# EAGLE design LF_front (EAGLE 9.6.2)
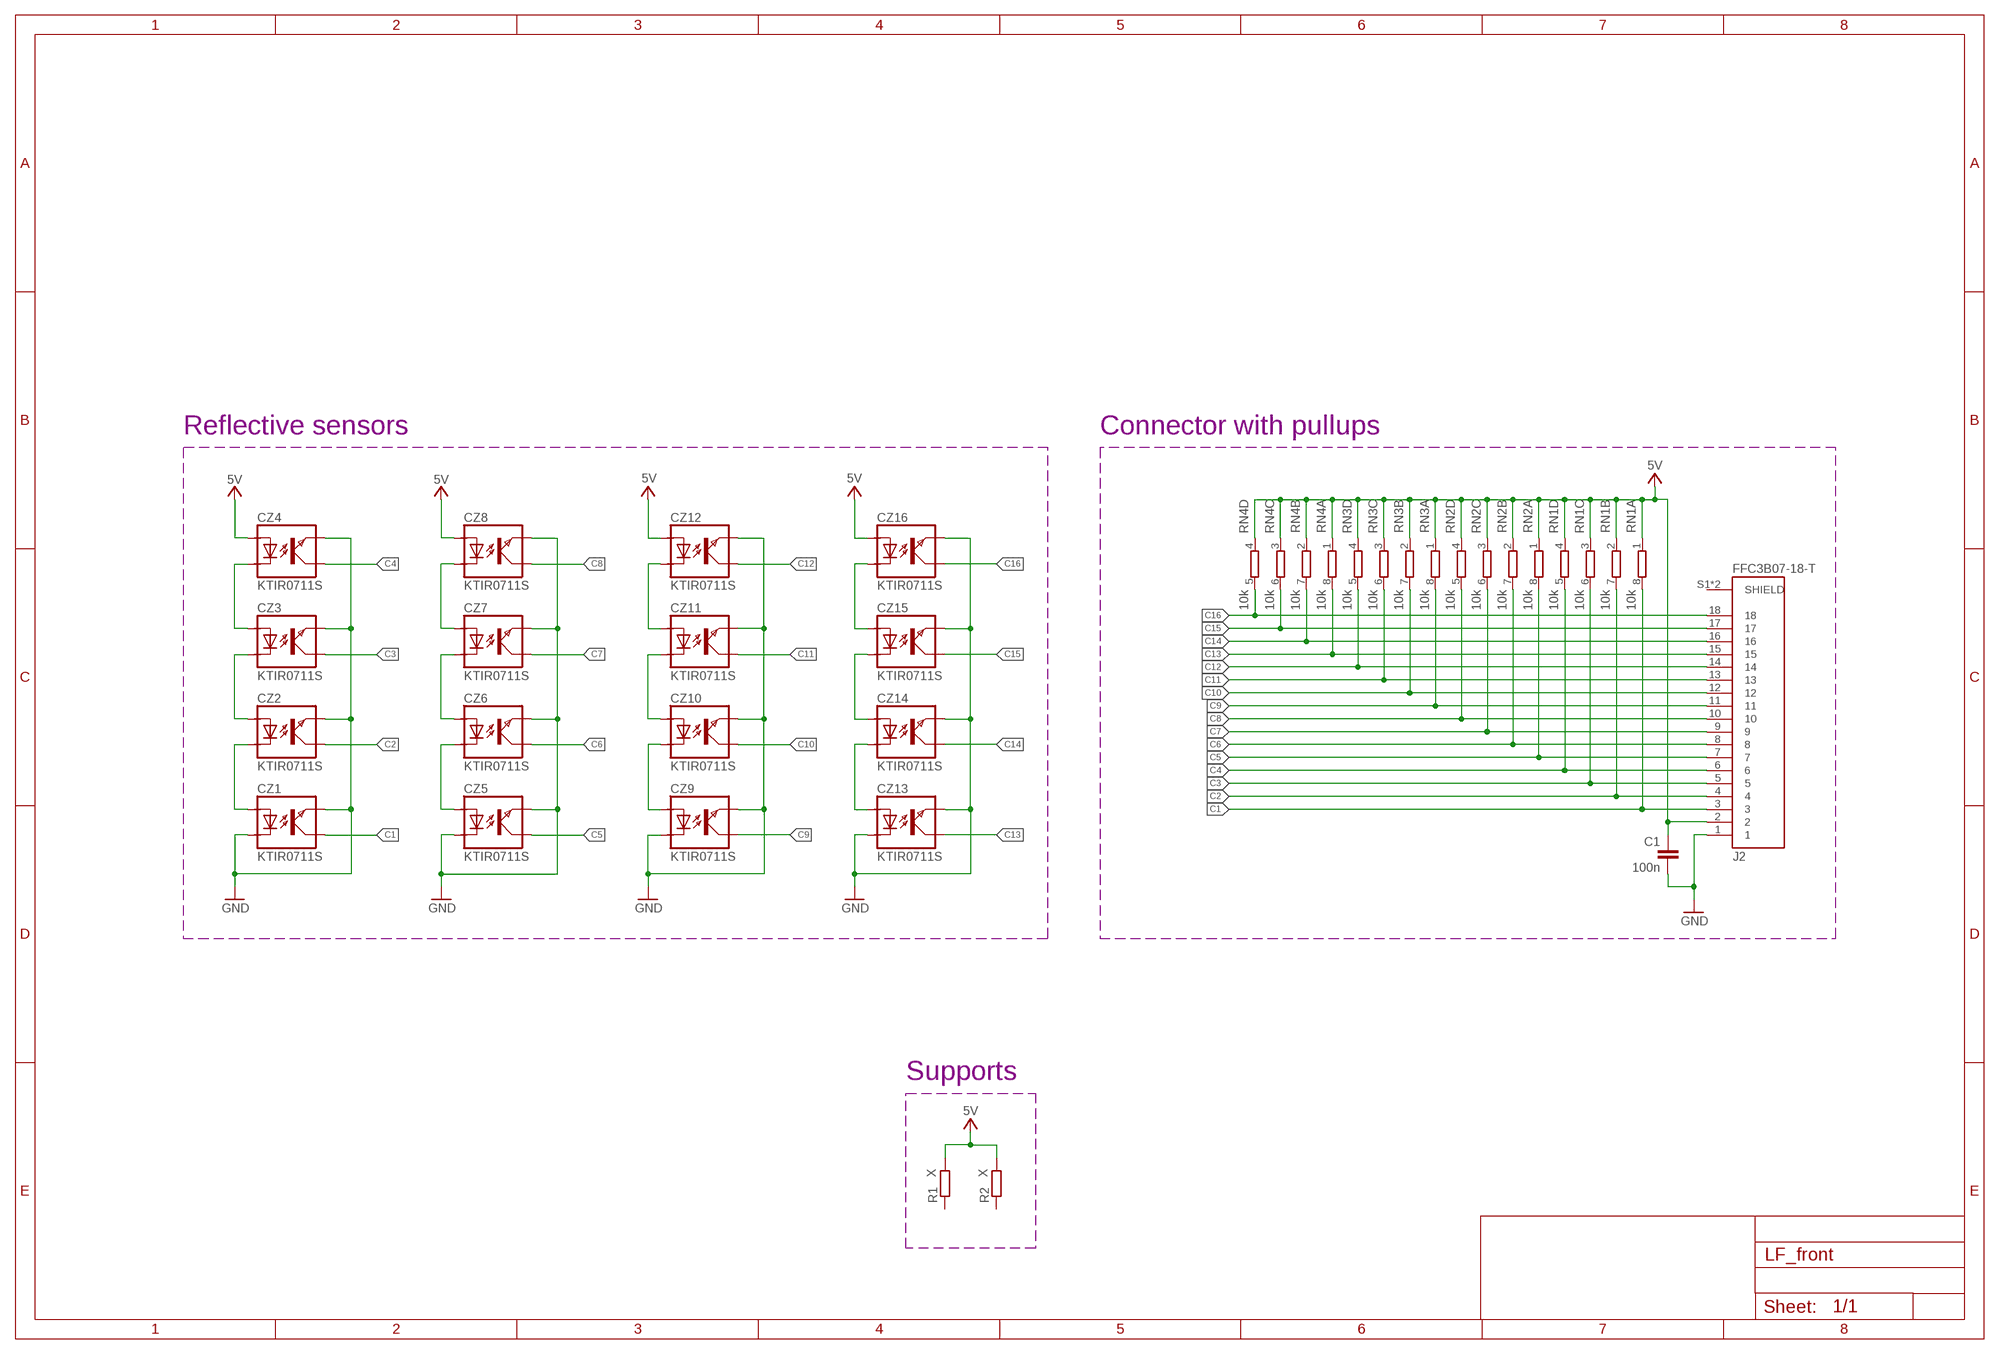
[diagram p0: schematic, sheet 1]

## Parts
C1  100n  C-EUC0402  [C0402]
CZ1  KTIR0711S  [TOP]
CZ2  KTIR0711S  [TOP]
CZ3  KTIR0711S  [TOP]
CZ4  KTIR0711S  [TOP]
CZ5  KTIR0711S  [TOP]
CZ6  KTIR0711S  [TOP]
CZ7  KTIR0711S  [TOP]
CZ8  KTIR0711S  [TOP]
CZ9  KTIR0711S  [TOP]
CZ10  KTIR0711S  [TOP]
CZ11  KTIR0711S  [TOP]
CZ12  KTIR0711S  [TOP]
CZ13  KTIR0711S  [TOP]
CZ14  KTIR0711S  [TOP]
CZ15  KTIR0711S  [TOP]
CZ16  KTIR0711S  [TOP]
J2  FFC3B07-18-T  [GCT_FFC3B07-18-T]
R1  X  R-EU_0207/7  [0207/7]
R2  X  R-EU_0207/7  [0207/7]
RN1  10k  4R-NEXB38V  [EXB38V]
RN2  10k  4R-NEXB38V  [EXB38V]
RN3  10k  4R-NEXB38V  [EXB38V]
RN4  10k  4R-NEXB38V  [EXB38V]

## Nets
5V: C1.2 CZ4.ANODA CZ8.ANODA CZ12.ANODA CZ16.ANODA J2.2 R1.2 R2.2 RN1.1 RN1.2 RN1.3 RN1.4 RN2.1 RN2.2 RN2.3 RN2.4 RN3.1 RN3.2 RN3.3 RN3.4 RN4.1 RN4.2 RN4.3 RN4.4 ; supply symbol labelled VCC
C1: CZ1.KOLEKTOR J2.3 RN1.8
C2: CZ2.KOLEKTOR J2.4 RN1.7
C3: CZ3.KOLEKTOR J2.5 RN1.6
C4: CZ4.KOLEKTOR J2.6 RN1.5
C5: CZ5.KOLEKTOR J2.7 RN2.8
C6: CZ6.KOLEKTOR J2.8 RN2.7
C7: CZ7.KOLEKTOR J2.9 RN2.6
C8: CZ8.KOLEKTOR J2.10 RN2.5
C9: CZ9.KOLEKTOR J2.11 RN3.8
C10: CZ10.KOLEKTOR J2.12 RN3.7
C11: CZ11.KOLEKTOR J2.13 RN3.6
C12: CZ12.KOLEKTOR J2.14 RN3.5
C13: CZ13.KOLEKTOR J2.15 RN4.8
C14: CZ14.KOLEKTOR J2.16 RN4.7
C15: CZ15.KOLEKTOR J2.17 RN4.6
C16: CZ16.KOLEKTOR J2.18 RN4.5
GND: C1.1 CZ1.EMITER CZ1.KATODA CZ2.EMITER CZ3.EMITER CZ4.EMITER CZ5.EMITER CZ5.KATODA CZ6.EMITER CZ7.EMITER CZ8.EMITER CZ9.EMITER CZ9.KATODA CZ10.EMITER CZ11.EMITER CZ12.EMITER CZ13.EMITER CZ13.KATODA CZ14.EMITER CZ15.EMITER CZ16.EMITER J2.1
N$2: CZ1.ANODA CZ2.KATODA
N$3: CZ2.ANODA CZ3.KATODA
N$4: CZ3.ANODA CZ4.KATODA
N$5: CZ15.ANODA CZ16.KATODA
N$6: CZ14.ANODA CZ15.KATODA
N$7: CZ13.ANODA CZ14.KATODA
N$8: CZ11.ANODA CZ12.KATODA
N$9: CZ10.ANODA CZ11.KATODA
N$10: CZ9.ANODA CZ10.KATODA
N$11: CZ5.ANODA CZ6.KATODA
N$12: CZ6.ANODA CZ7.KATODA
N$13: CZ7.ANODA CZ8.KATODA
Unconnected: J2.S1(SHIELD) J2.S2(SHIELD) R1.1 R2.1

## Notes on the sheet
- Reflective sensors | Connector with pullups
- Supports

## Library data of the parts
C1 = rcl:C-EU: CAPACITOR, European symbol; SPICEPREFIX: C
CZ1-CZ16 = KTIR0711S:KTIR0711S
J2 = FFC18T_1mm:FFC3B07-18-T: FPC 1.0mm Pitch, Side entry, Top contact, SMT, Height 2.5mm, Slide type; MANUFACTURER: GCT; MAXIMUM_PACKAGE_HEIGHT: 2.5mm; PARTREV: A; STANDARD: Manufacturer Recommendations
R1 R2 = rcl:R-EU_: RESISTOR, European symbol; SPICEPREFIX: R
RN1-RN4 = resistor-dil:4R-N: Array Chip Resistor Source: RS Component / Phycomp; OC_FARNELL: unknown; OC_NEWARK: unknown

## Board
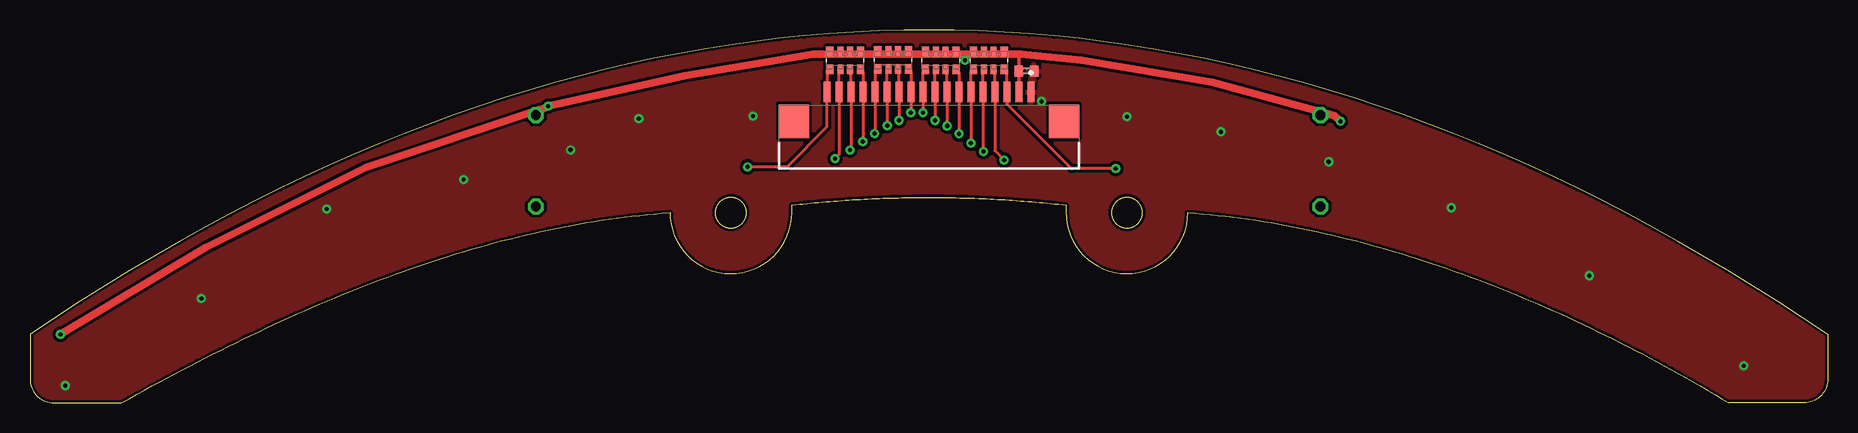
[diagram p1: board, top side]
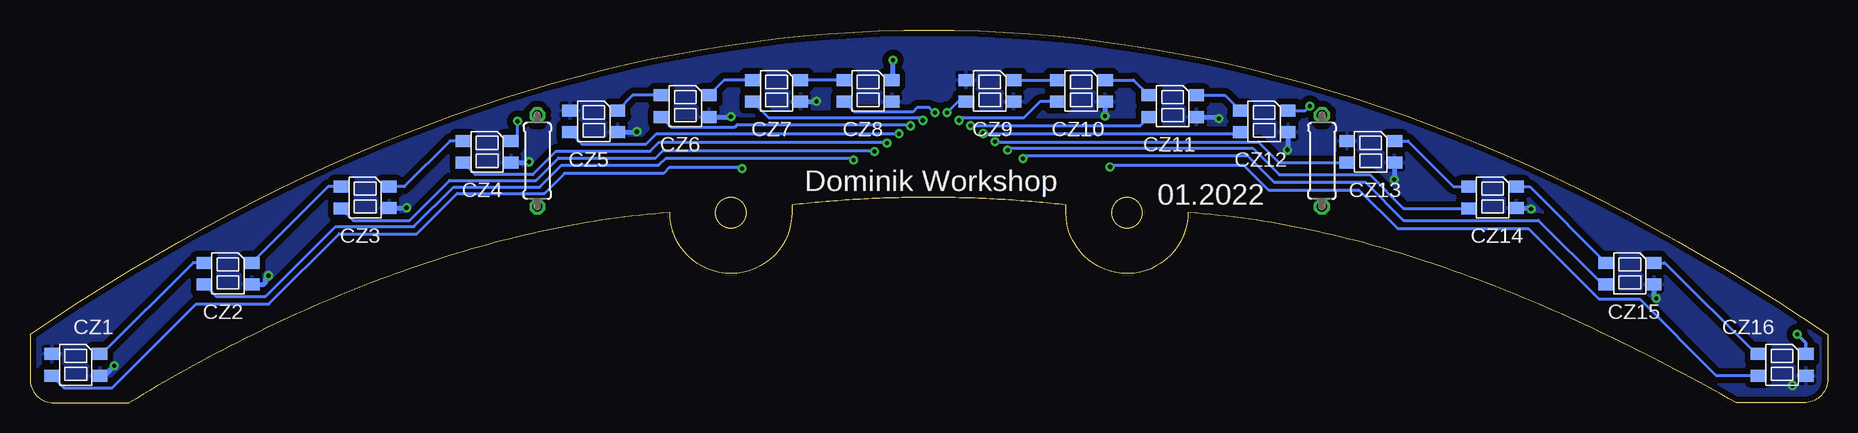
[diagram p2: board, bottom side, seen from below]

Size 149.86 x 31.12 mm. Coordinates in mm from the lower left corner, seen from the top.
Outline: 0,5.71 0,2 arc90 2,0 7.62,0 8.26,0.36 8.89,0.71 9.53,1.06 10.16,1.41 10.79,1.75 11.43,2.09 12.06,2.43 12.7,2.77 13.34,3.1 13.97,3.43 14.61,3.76 15.24,4.08 15.88,4.4 16.51,4.72 17.14,5.03 17.78,5.34 18.41,5.64 19.05,5.95 19.68,6.25 20.32,6.54 20.95,6.84 21.59,7.12 22.23,7.41 22.86,7.69 23.5,7.97 24.13,8.24 24.77,8.51 25.4,8.78 26.04,9.04 26.67,9.3 27.3,9.55 27.94,9.8 28.57,10.04 29.21,10.29 29.84,10.52 30.48,10.75 31.11,10.98 31.75,11.21 32.38,11.43 33.02,11.64 33.66,11.85 34.29,12.06 34.92,12.26 35.56,12.46 36.2,12.65 36.83,12.83 37.47,13.02 38.1,13.19 38.73,13.37 39.37,13.53 40.01,13.7 40.64,13.85 41.27,14.01 41.91,14.15 42.55,14.3 43.18,14.43 43.81,14.56 44.45,14.69 45.09,14.81 45.72,14.93 46.35,15.04 46.99,15.14 47.62,15.24 48.26,15.33 48.9,15.42 49.53,15.5 50.16,15.58 50.8,15.65 51.44,15.72 52.07,15.77 52.7,15.83 53.34,15.88 53.36,15.43 arc175 63.5,15.88 63.5,16.51 63.82,16.54 64.14,16.58 64.45,16.61 64.77,16.64 65.09,16.67 65.41,16.7 65.72,16.73 66.04,16.76 66.36,16.79 66.67,16.81 66.99,16.84 67.31,16.86 67.63,16.89 67.94,16.91 68.26,16.93 68.58,16.95 68.9,16.97 69.22,16.99 69.53,17 69.85,17.02 70.17,17.04 70.48,17.05 70.8,17.06 71.12,17.07 71.44,17.09 71.75,17.1 72.07,17.11 72.39,17.11 72.71,17.12 73.03,17.13 73.34,17.13 73.66,17.14 73.98,17.14 74.3,17.14 74.61,17.14 74.93,17.14 75.25,17.14 75.56,17.14 75.88,17.14 76.2,17.14 76.52,17.13 76.83,17.13 77.15,17.12 77.47,17.11 77.79,17.11 78.11,17.1 78.42,17.09 78.74,17.07 79.06,17.06 79.38,17.05 79.69,17.04 80.01,17.02 80.33,17 80.64,16.99 80.96,16.97 81.28,16.95 81.6,16.93 81.92,16.91 82.23,16.89 82.55,16.86 82.87,16.84 83.19,16.81 83.5,16.79 83.82,16.76 84.14,16.73 84.45,16.7 84.77,16.67 85.09,16.64 85.41,16.61 85.72,16.58 86.04,16.54 86.36,16.51 86.36,15.88 86.38,15.43 arc175 96.52,15.88 97.15,15.83 97.78,15.77 98.4,15.72 99.03,15.65 99.66,15.58 100.3,15.5 100.93,15.42 101.56,15.33 102.19,15.24 102.83,15.14 103.46,15.04 104.1,14.93 104.74,14.81 105.37,14.69 106.01,14.56 106.65,14.43 107.29,14.3 107.92,14.15 108.56,14.01 109.2,13.85 109.84,13.7 110.48,13.53 111.12,13.37 111.76,13.19 112.4,13.02 113.04,12.83 113.68,12.65 114.32,12.46 114.96,12.26 115.59,12.06 116.23,11.85 116.87,11.64 117.51,11.43 118.15,11.21 118.78,10.98 119.42,10.75 120.06,10.52 120.69,10.29 121.33,10.04 121.96,9.8 122.59,9.55 123.22,9.3 123.86,9.04 124.49,8.78 125.12,8.51 125.75,8.24 126.37,7.97 127,7.69 127.63,7.41 128.25,7.12 128.87,6.84 129.5,6.54 130.12,6.25 130.74,5.95 131.35,5.64 131.97,5.34 132.59,5.03 133.2,4.72 133.81,4.4 134.42,4.08 135.03,3.76 135.64,3.43 136.24,3.1 136.85,2.77 137.45,2.43 138.05,2.09 138.65,1.75 139.24,1.41 139.84,1.06 140.43,0.71 141.02,0.36 141.6,0 147.86,0 arc90 149.86,2 149.86,5.71 147.78,7.11 145.7,8.46 143.62,9.77 141.53,11.05 139.45,12.28 137.37,13.48 135.29,14.63 133.21,15.75 131.13,16.83 129.05,17.87 126.97,18.87 124.88,19.83 122.8,20.75 120.72,21.63 118.64,22.47 116.56,23.28 114.48,24.04 112.39,24.77 110.31,25.45 108.23,26.1 106.15,26.7 104.07,27.27 101.99,27.8 99.91,28.29 97.83,28.74 95.74,29.16 93.66,29.53 91.58,29.86 89.5,30.16 87.42,30.41 85.34,30.62 83.26,30.8 81.17,30.94 79.09,31.04 77.01,31.09 74.93,31.12 72.85,31.09 70.77,31.04 68.69,30.94 66.6,30.8 64.52,30.62 62.44,30.41 60.36,30.16 58.28,29.86 56.2,29.53 54.12,29.16 52.03,28.74 49.95,28.29 47.87,27.8 45.79,27.27 43.71,26.7 41.63,26.1 39.55,25.45 37.47,24.77 35.38,24.04 33.3,23.28 31.22,22.47 29.14,21.63 27.06,20.75 24.98,19.83 22.89,18.87 20.81,17.87 18.73,16.83 16.65,15.75 14.57,14.63 12.49,13.48 10.41,12.28 8.33,11.05 6.24,9.77 4.16,8.46 2.08,7.11 0,5.71
Outline: circle at 91.44,15.88 radius 1.27
Outline: circle at 58.42,15.88 radius 1.27
Copper layers (1*16): Top 0.035mm / dielectric 1.5mm / Bottom 0.035mm
Design rules "default *": minimum track width 6mil, minimum drill 0.35mm, track to track 6mil, track to pad 6mil, pad to pad 6mil, via to via 6mil, smd to smd 6mil, copper to edge 4mil, drill to drill 6mil, minimum pad ring 10mil, minimum via ring 8mil, stop-mask expansion 4mil, vias tented up to drill 14mil, thermal gap 10mil

### Footprints (pad centres in the part's own frame; a part is rotated, then mirrored left to right if it is on the bottom)
C0402 = smd 0.7 x 0.9: 1 -0.65,0; 2 0.65,0
TOP = smd 1.27 x 1: ANODA -1.985,-0.9; EMITER -1.985,0.9; KATODA 1.985,-0.9; KOLEKTOR 1.985,0.91
GCT_FFC3B07-18-T = smd 0.6 x 1.7: 1 8.5,2.45; 2 7.5,2.45; 3 6.5,2.45; 4 5.5,2.45; 5 4.5,2.45; 6 3.5,2.45; 7 2.5,2.45; 8 1.5,2.45; 9 0.5,2.45; 10 -0.5,2.45; 11 -1.5,2.45; 12 -2.5,2.45; 13 -3.5,2.45; 14 -4.5,2.45; 15 -5.5,2.45; 16 -6.5,2.45; 17 -7.5,2.45; 18 -8.5,2.45 | smd 2.5 x 2.8: S1 11.25,0; S2 -11.25,0
0207/7 = drill 0.813 octagon: 1 -3.81,0; 2 3.81,0
EXB38V = smd 0.6 x 0.8: 1 -1.275,-0.75; 4 1.275,-0.75; 5 1.275,0.75; 8 -1.275,0.75 | smd 0.5 x 0.8: 2 -0.4,-0.75; 3 0.4,-0.75; 6 0.4,0.75; 7 -0.4,0.75

### Placement (x,y rotation side)
C1  83.06,27.69 180 top
CZ1  146.05,3.17 180 bottom
CZ2  133.35,10.79 180 bottom
CZ3  121.92,17.14 180 bottom
CZ4  111.76,20.95 180 bottom
CZ5  102.87,23.5 180 bottom
CZ6  95.25,24.77 180 bottom
CZ7  87.63,26.04 180 bottom
CZ8  80.01,26.04 180 bottom
CZ9  69.85,26.04 180 bottom
CZ10  62.23,26.04 180 bottom
CZ11  54.61,24.77 180 bottom
CZ12  46.99,23.5 180 bottom
CZ13  38.1,20.95 180 bottom
CZ14  27.94,17.14 180 bottom
CZ15  16.51,10.79 180 bottom
CZ16  3.81,3.17 180 bottom
J2  74.93,23.5 0 top
R1  107.57,20.19 90 bottom
R2  42.16,20.19 90 bottom
RN1  79.93,28.58 180 top
RN2  75.91,28.58 180 top
RN3  71.95,28.61 180 top
RN4  67.94,28.58 180 top

### Tracks (layer width: path | path; a pad name or v marks a point on that pad's centre or on a via)
5V  (via drill 0.35)
  Top 0.152: RN4.3 67.55,29.31 67.31,29.08 | RN4.2 68.34,29.31 68.58,29.08 | RN4.1 69.22,29.08
  Top 0.254: C1.2 82.43,27.66 82.43,27.3 | RN1.1 81.45,29.08 81.92,29.08 | 82.43,28.91 82.6,29.08 | RN2.4 74.68,29.33 74.93,29.08 | RN2.3 75.56,29.27 75.56,29.08 | RN2.2 76.31,29.19 76.2,29.08 | RN2.1 77.22,29.33 77.47,29.08 | RN4.4 66.67,29.08 | RN3.1 73.22,29.27 73.03,29.08 | RN3.2 72.35,29.16 72.33,29.14 | RN3.3 71.55,29.29 71.75,29.08 | RN3.4 70.67,29.26 70.48,29.08 | R2.2 42.16,24.19 42.44,24.46
  Top 0.305: J2.2 82.43,27.3 82.43,28.91
  Top 0.406: v77.93,28.6 77.93,28.9 78.11,29.08 | 72.33,29.14 72.39,29.08 | RN1.4 78.74,29.24 78.74,29.08 | RN1.3 79.53,29.23 79.38,29.08 | RN1.2 80.4,29.33 80.64,29.08 | RN1.1 81.28,29.25 81.28,29.08
  Top 0.61: v2.54,5.71 14.64,12.97 27.97,19.64 42.44,24.46 42.62,24.52 43.1,24.68 v43.18,24.77 54.61,27.3 65.27,29.08 66.67,29.08 67.31,29.08 68.58,29.08 69.22,29.08 70.48,29.08 71.75,29.08 72.39,29.08 73.03,29.08 74.93,29.08 75.56,29.08 76.2,29.08 77.47,29.08 78.11,29.08 78.74,29.08 79.38,29.08 80.64,29.08 81.28,29.08 81.92,29.08 82.6,29.08 83.86,28.95 87.63,28.58 98.52,26.76 106.62,24.55 107.37,24.34 107.37,24.2 R1.2 107.75,24.18 107.97,24.18 108.74,23.97 v109.22,23.5
  Bottom 0.254: CZ12.ANODA 43.55,24.39 v43.18,24.77 | CZ4.ANODA 109.22,22.41 v109.22,23.5
  Bottom 0.305: CZ16.ANODA 1.82,5 v2.54,5.71
  Bottom 0.406: CZ8.ANODA 77.95,27.01 77.95,28.5 77.93,28.52 v77.93,28.6
C1  (via drill 0.35)
  Top 0.254: RN1.8 81.43,27.6 J2.3 81.43,24.95 86.83,19.55 v90.5,19.55
  Bottom 0.254: CZ1.KOLEKTOR 147.04,1.27 143,1.27 136.02,8.25 129.95,8.25 124.1,14.1 117.61,14.1 114.24,17.48 106.97,17.48 105.31,19.14 97.07,19.14 96.53,19.67 90.62,19.67 v90.5,19.55
C2  (via drill 0.35)
  Top 0.254: 80.43,27.72 J2.4 80.43,21.04 v81.2,20.27
  Top 0.305: 80.43,27.72 RN1.7
  Bottom 0.254: CZ2.KOLEKTOR 134.34,8.89 130.2,8.89 124.38,14.71 117.87,14.71 114.57,18.01 107.38,18.01 105.56,19.82 97.45,19.82 96.89,20.38 81.32,20.38 v81.2,20.27
C3  (via drill 0.35)
  Top 0.254: 79.43,27.73 J2.5 79.43,21.02 v79.47,20.98
  Top 0.305: 79.43,27.73 RN1.6
  Bottom 0.254: CZ3.KOLEKTOR 122.91,15.24 118.2,15.24 114.88,18.55 107.68,18.55 105.8,20.43 97.71,20.43 97.08,21.07 79.57,21.07 v79.47,20.98
C4  (via drill 0.35)
  Top 0.254: 78.43,26.04 78.43,27.6 RN1.5 | J2.6 v78.43,21.7 v78.42,21.69
  Top 0.406: J2.6 78.43,26.04
  Bottom 0.152: v78.42,21.69 78.43,21.69
  Bottom 0.254: CZ4.KOLEKTOR 112.75,19.05 107.95,19.05 106,21 98.16,21 97.41,21.75 78.5,21.75 78.43,21.69
C5  (via drill 0.35)
  Top 0.254: v77.43,22.45 v77.43,22.46 J2.7 77.43,27.61 77.22,27.83 RN2.8
  Bottom 0.254: CZ5.KOLEKTOR 103.86,21.59 98.51,21.59 97.65,22.45 v77.43,22.45
C6  (via drill 0.35)
  Top 0.254: v76.45,23.11 76.43,23.14 J2.8 76.43,27.71 RN2.7
  Bottom 0.254: CZ6.KOLEKTOR 96.41,23.02 91.11,23.02 90.91,23.23 76.57,23.23 v76.45,23.11
C7  (via drill 0.35)
  Top 0.254: v75.44,23.57 v75.43,23.58 J2.9 75.43,27.74 RN2.6
  Bottom 0.254: CZ7.KOLEKTOR 88.3,23.81 75.68,23.81 v75.44,23.57
C8  (via drill 0.35)
  Top 0.254: v74.44,24.22 v74.43,24.22 J2.10 74.43,27.62 RN2.5
  Bottom 0.152: v74.44,24.22 74.5,24.22
  Bottom 0.254: CZ8.KOLEKTOR 81.24,24.37 81.14,24.27 76.28,24.27 75.91,24.64 74.92,24.64 74.5,24.22
C9  (via drill 0.35)
  Top 0.254: v73.42,24.23 v73.43,24.24 J2.11 73.43,27.65 RN3.8
  Bottom 0.254: CZ9.KOLEKTOR 72.53,25.12 v73.42,24.23
C10  (via drill 0.35)
  Top 0.254: v72.43,23.57 72.43,25.77 J2.12 72.43,27.77 RN3.7
  Bottom 0.254: CZ10.KOLEKTOR 65.68,25.12 66.99,23.81 72.11,23.81 72.35,23.57 v72.43,23.57
C11  (via drill 0.35)
  Top 0.254: v71.46,23.15 71.43,23.17 J2.13 71.43,27.74 RN3.6
  Bottom 0.254: CZ11.KOLEKTOR 57.3,23.15 v71.46,23.15
C12  (via drill 0.35)
  Top 0.254: v70.4,22.48 70.43,22.51 J2.14 70.43,27.62 70.44,27.62 RN3.5
  Bottom 0.152: 49.08,22.48 CZ12.KOLEKTOR
  Bottom 0.254: v70.4,22.48 49.08,22.48
C13  (via drill 0.35)
  Top 0.152: RN4.8 69.43,27.62 69.43,27.59
  Top 0.254: 69.43,27.59 J2.15 v69.43,21.8 v69.42,21.79
  Bottom 0.152: v69.42,21.79 69.39,21.77
  Bottom 0.254: 69.39,21.77 47.46,21.77 45.74,20.04 CZ13.KOLEKTOR
C14  (via drill 0.35)
  Top 0.254: v68.36,21.09 68.41,21.09 68.43,21.12 J2.16 68.43,27.74 RN4.7
  Bottom 0.152: v68.36,21.09 68.21,21.25
  Bottom 0.254: 68.21,21.25 47.93,21.25 45.73,19.05 38.19,19.05 35.37,16.23 CZ14.KOLEKTOR
C15  (via drill 0.35)
  Top 0.254: v67.09,20.4 67.43,20.73 J2.17 67.43,27.71 RN4.6
  Bottom 0.152: v67.09,20.4 66.86,20.62 | 18.77,9.88 CZ15.KOLEKTOR
  Bottom 0.254: 66.86,20.62 48.36,20.62 46.15,18.41 38.54,18.41 35.37,15.24 24.13,15.24 18.77,9.88
C16  (via drill 0.35)
  Top 0.152: RN4.5 66.44,27.6 66.43,27.6
  Top 0.254: v59.82,19.69 63.09,19.69 66.43,23.03 J2.18 66.43,27.6
  Bottom 0.254: CZ16.KOLEKTOR 9.3,2.26 15.69,8.66 19.09,8.66 24.97,14.54 35.85,14.54 39.09,17.78 46.62,17.78 48.7,19.86 59.66,19.86 v59.82,19.69
GND  (via drill 0.35)
  Bottom 0.406: CZ15.EMITER 14.53,8.96 v14.29,8.72 | CZ1.EMITER 143.67,2.27 v142.85,3.1 | CZ2.EMITER 130.39,9.89 130.25,10.03 130.25,10.35 v129.98,10.62 | CZ3.EMITER 118.52,16.25 v118.48,16.28 | CZ4.EMITER 108.32,20.05 v108.25,20.12 | CZ5.EMITER 99.3,22.59 v99.28,22.62 | CZ6.EMITER 91.6,23.86 91.55,23.91 91.48,23.91 v91.44,23.88 | CZ7.EMITER 85.63,25.12 84.34,25.12 v84.3,25.16 | CZ14.EMITER 24.79,16.25 v24.73,16.18 | CZ13.EMITER 36.12,18.67 v36.14,18.64 | CZ12.EMITER 45.01,21.15 v45.05,21.11 | CZ11.EMITER 50.9,23.86 v50.75,23.71 | CZ10.EMITER 60.24,23.96 v60.26,23.94
  other vias: 2.95,1.45
  pour Bottom (isolate 0.508): 0,0 149.86,0 149.86,5.71 124.46,31.12 25.4,31.12 0,5.71
  pour Top (isolate 0.254): 0,0 0,5.19 arc-45 0.37,6.09 25.4,31.12 124.46,31.12 149.86,5.71 149.86,0
N$2
  Bottom 0.254: CZ2.KATODA 136.26,11.7 143.88,4.07 CZ1.ANODA
N$3
  Bottom 0.254: CZ3.KATODA 125.02,18.04 CZ2.ANODA
N$4
  Bottom 0.254: CZ4.KATODA 114.86,21.86 118.67,18.04 CZ3.ANODA
N$5
  Bottom 0.152: CZ16.KATODA 5.98,4.07
  Bottom 0.254: CZ15.ANODA 13.6,11.7 5.98,4.07
N$6
  Bottom 0.254: CZ14.ANODA 24.84,18.04 CZ15.KATODA
N$7
  Bottom 0.254: CZ13.ANODA 35.01,21.86 31.2,18.04 CZ14.KATODA
N$8
  Bottom 0.254: CZ11.ANODA 50.24,25.66 CZ12.KATODA
N$9
  Bottom 0.254: CZ10.ANODA 57.87,26.93 CZ11.KATODA
N$10
  Bottom 0.254: CZ9.ANODA CZ10.KATODA
N$11
  Bottom 0.254: CZ6.KATODA 99.61,25.66 CZ5.ANODA
N$12
  Bottom 0.254: CZ7.KATODA 92,26.93 CZ6.ANODA
N$13
  Bottom 0.254: CZ8.KATODA CZ7.ANODA

### Text on the board
bNames: Dominik Workshop | 01.2022